# Altium project foc_control.PrjPcb
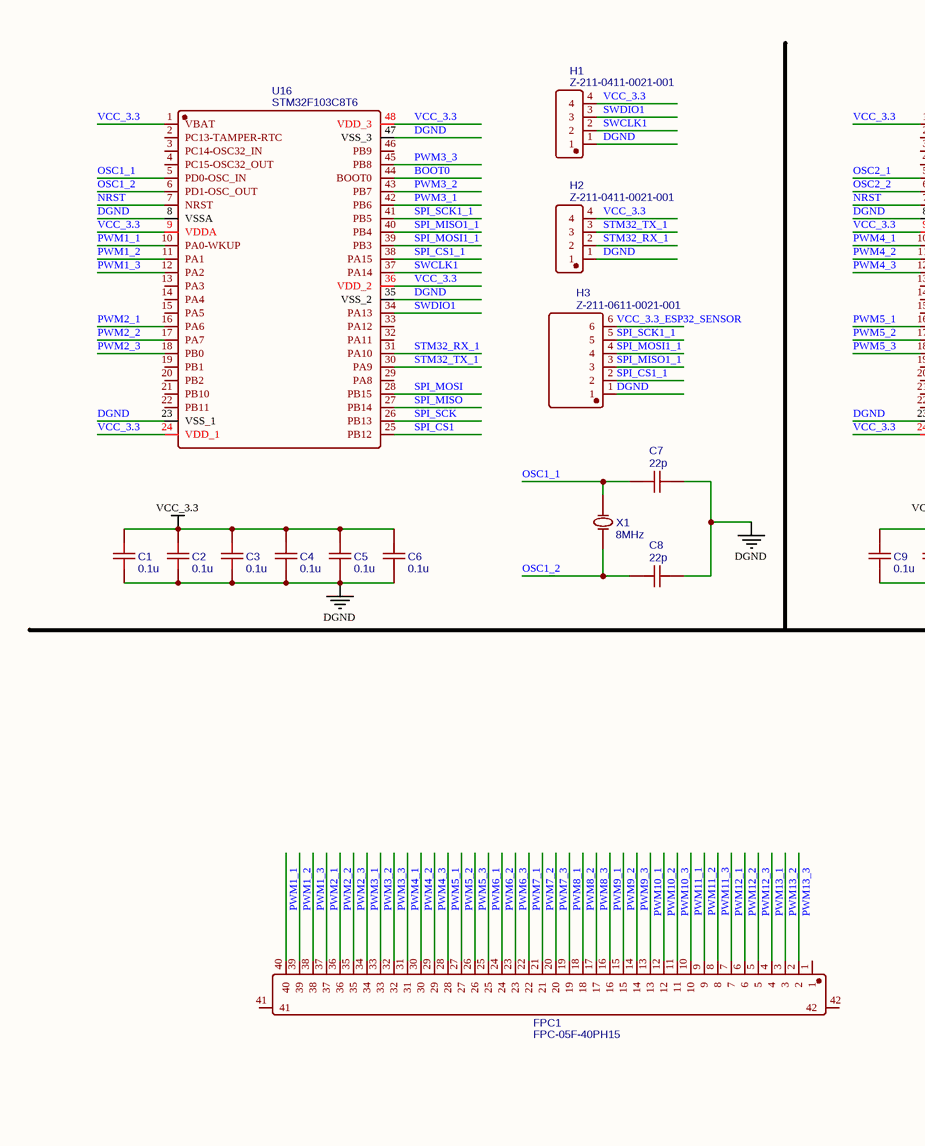
[diagram p0: quark_dog_control.schdoc, left]
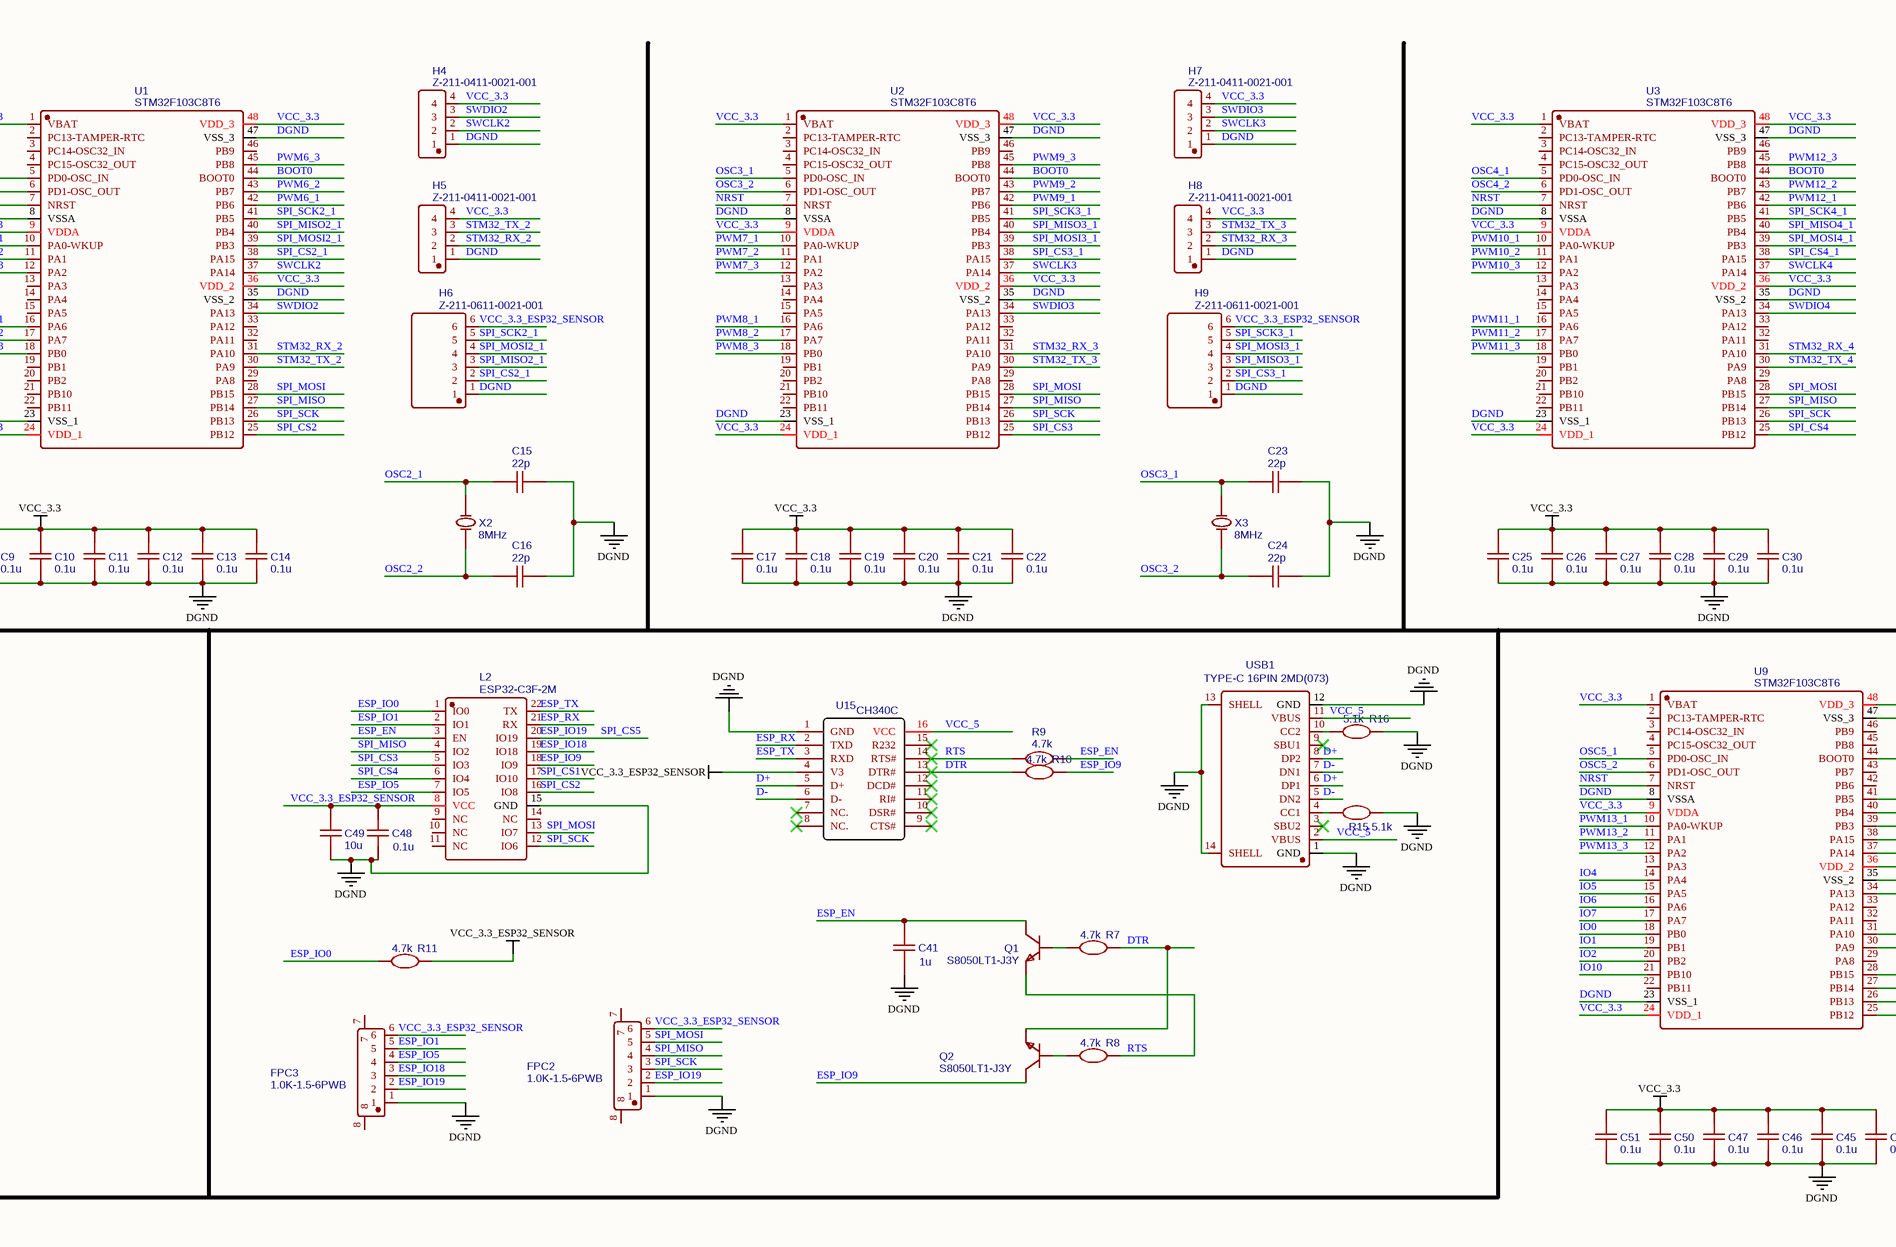
[diagram p1: quark_dog_control.schdoc, middle]
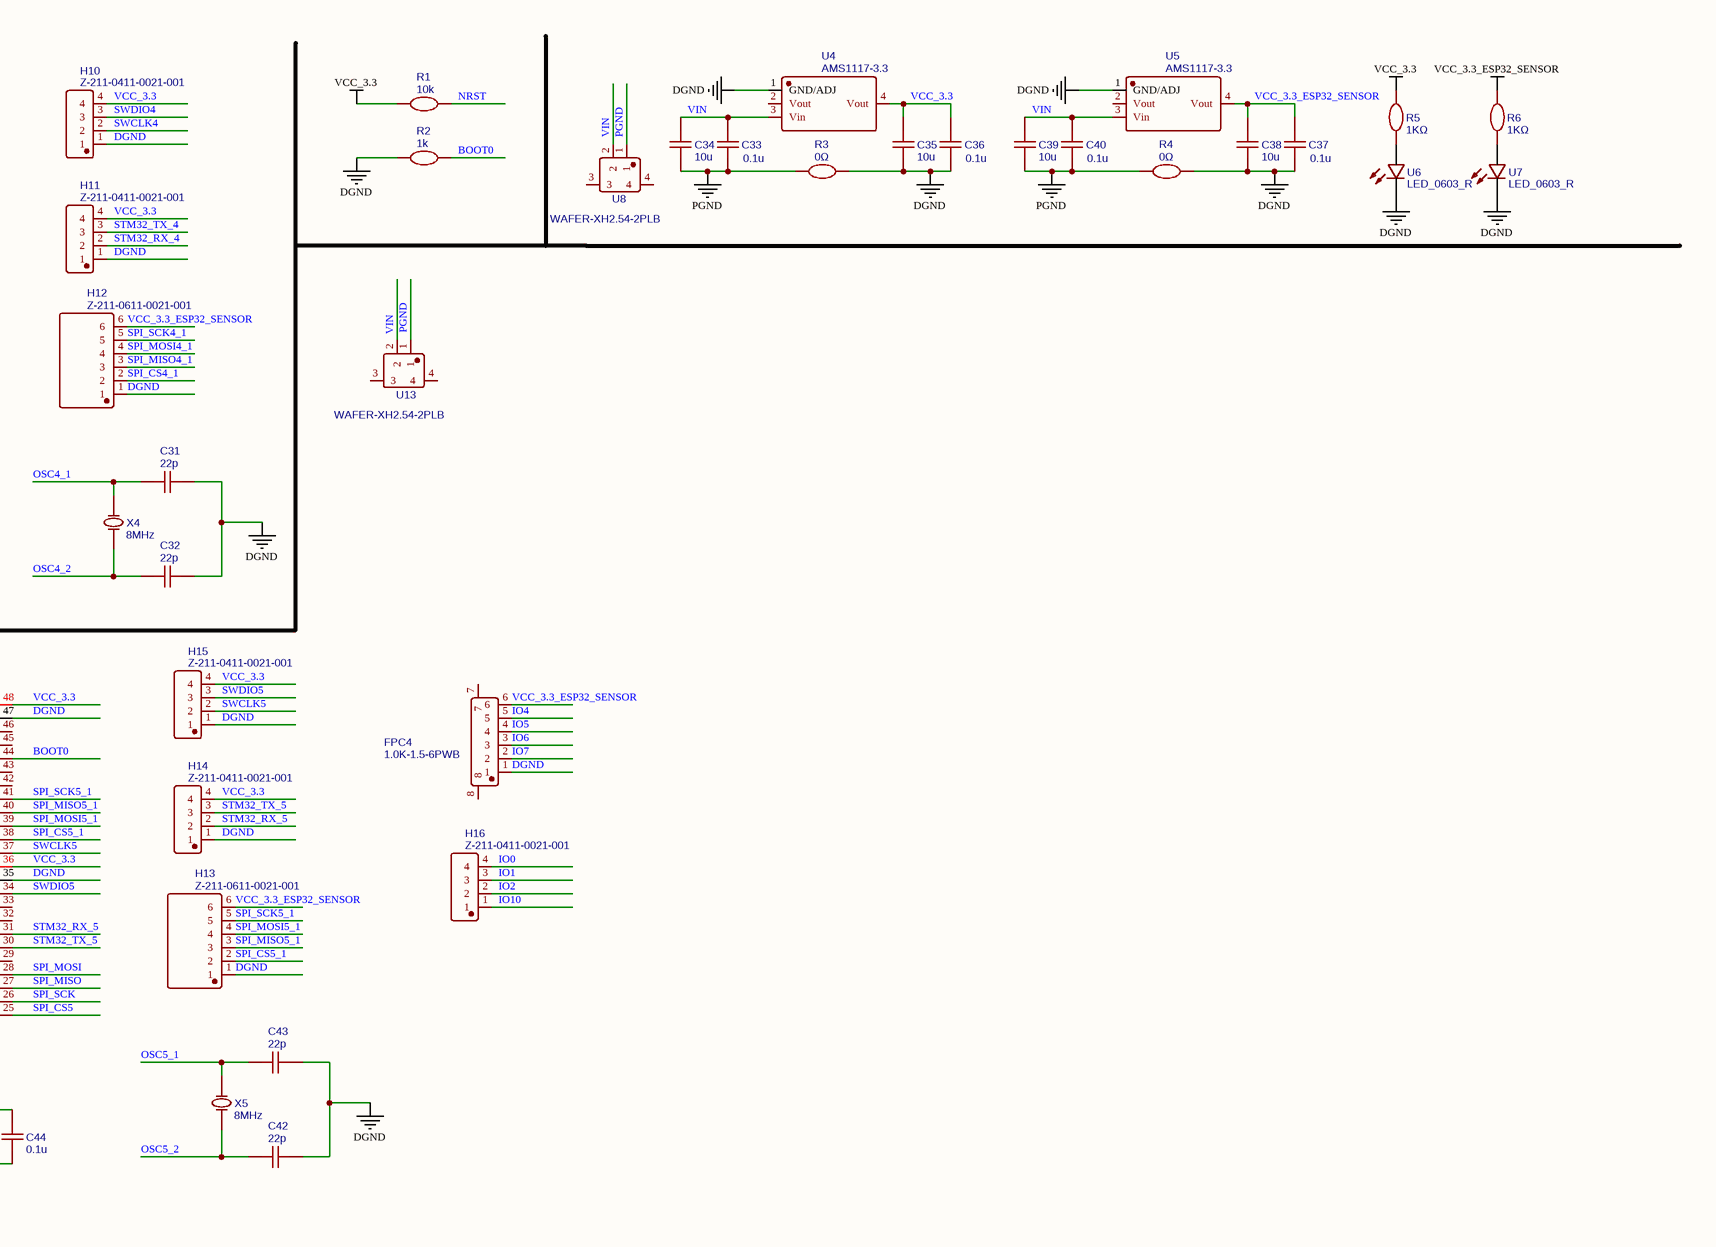
[diagram p2: quark_dog_control.schdoc, right]
1 sheet, 105 parts. Net scope: global (net labels, ports and power ports of the same name join across sheets).
Board file: quark_dog_control.PcbDoc

## Sheet quark_dog_control.schdoc
size 850 x 239 mm; SheetNumber: 1; SheetTotal: 1

### Parts
C1  0.1u  [C0603]
C2  0.1u  [C0603]
C3  0.1u  [C0603]
C4  0.1u  [C0603]
C5  0.1u  [C0603]
C6  0.1u  [C0603]
C7  22p  [C0603]
C8  22p  [C0603]
C9  0.1u  [C0603]
C10  0.1u  [C0603]
C11  0.1u  [C0603]
C12  0.1u  [C0603]
C13  0.1u  [C0603]
C14  0.1u  [C0603]
C15  22p  [C0603]
C16  22p  [C0603]
C17  0.1u  [C0603]
C18  0.1u  [C0603]
C19  0.1u  [C0603]
C20  0.1u  [C0603]
C21  0.1u  [C0603]
C22  0.1u  [C0603]
C23  22p  [C0603]
C24  22p  [C0603]
C25  0.1u  [C0603]
C26  0.1u  [C0603]
C27  0.1u  [C0603]
C28  0.1u  [C0603]
C29  0.1u  [C0603]
C30  0.1u  [C0603]
C31  22p  [C0603]
C32  22p  [C0603]
C33  0.1u  [C0603]
C34  10u  [C0603]
C35  10u  [C0603]
C36  0.1u  [C0603]
C37  0.1u  [C0603]
C38  10u  [C0603]
C39  10u  [C0603]
C40  0.1u  [C0603]
C41  1u  [C0603]
C42  22p  [C0603]
C43  22p  [C0603]
C44  0.1u  [C0603]
C45  0.1u  [C0603]
C46  0.1u  [C0603]
C47  0.1u  [C0603]
C48  0.1u  [C0603]
C49  10u  [C0603]
C50  0.1u  [C0603]
C51  0.1u  [C0603]
FPC1  FPC-05F-40PH15  [FPC-SMD_40P-P0.50_FPC-05F-40PH15]
FPC2  1.0K-1.5-6PWB  [FPC-SMD_6P-P1.00_HDGC_1.0K-1.5-6PWB]
FPC3  1.0K-1.5-6PWB  [FPC-SMD_6P-P1.00_HDGC_1.0K-1.5-6PWB]
FPC4  1.0K-1.5-6PWB  [FPC-SMD_6P-P1.00_HDGC_1.0K-1.5-6PWB]
H1  Z-211-0411-0021-001  [HDR-TH_4P-P2.54-V-M]
H2  Z-211-0411-0021-001  [HDR-TH_4P-P2.54-V-M]
H3  Z-211-0611-0021-001  [HDR-TH_6P-P2.54-V_Z-211-0611-0021-001]
H4  Z-211-0411-0021-001  [HDR-TH_4P-P2.54-V-M]
H5  Z-211-0411-0021-001  [HDR-TH_4P-P2.54-V-M]
H6  Z-211-0611-0021-001  [HDR-TH_6P-P2.54-V_Z-211-0611-0021-001]
H7  Z-211-0411-0021-001  [HDR-TH_4P-P2.54-V-M]
H8  Z-211-0411-0021-001  [HDR-TH_4P-P2.54-V-M]
H9  Z-211-0611-0021-001  [HDR-TH_6P-P2.54-V_Z-211-0611-0021-001]
H10  Z-211-0411-0021-001  [HDR-TH_4P-P2.54-V-M]
H11  Z-211-0411-0021-001  [HDR-TH_4P-P2.54-V-M]
H12  Z-211-0611-0021-001  [HDR-TH_6P-P2.54-V_Z-211-0611-0021-001]
H13  Z-211-0611-0021-001  [HDR-TH_6P-P2.54-V_Z-211-0611-0021-001]
H14  Z-211-0411-0021-001  [HDR-TH_4P-P2.54-V-M]
H15  Z-211-0411-0021-001  [HDR-TH_4P-P2.54-V-M]
H16  Z-211-0411-0021-001  [HDR-TH_4P-P2.54-V-M]
L2  ESP32-C3F-2M  [WIFIM-SMD_ESP32-C3F-2M]
Q1  S8050LT1-J3Y  [SOT-23_L2.9-W1.3-P1.90-LS2.4-BR]
Q2  S8050LT1-J3Y  [SOT-23_L2.9-W1.3-P1.90-LS2.4-BR]
R1  10k  [R0603]
R2  1k  [R0603]
R3  0Ω  [R0603]
R4  0Ω  [R0603]
R5  1KΩ  [R0603]
R6  1KΩ  [R0603]
R7  4.7k  [R0603]
R8  4.7k  [R0603]
R9  4.7k  [R0603]
R10  4.7k  [R0603]
R11  4.7k  [R0603]
R15  5.1k  [R0603]
R16  5.1k  [R0603]
U1  STM32F103C8T6  [LQFP-48_L7.0-W7.0-P0.50-LS9.0-BL]
U2  STM32F103C8T6  [LQFP-48_L7.0-W7.0-P0.50-LS9.0-BL]
U3  STM32F103C8T6  [LQFP-48_L7.0-W7.0-P0.50-LS9.0-BL]
U4  AMS1117-3.3  [SOT-223-3_L6.5-W3.4-P2.30-LS7.0-BR]
U5  AMS1117-3.3  [SOT-223-3_L6.5-W3.4-P2.30-LS7.0-BR]
U6  LED_0603_R  [LED0603-RD]
U7  LED_0603_R  [LED0603-RD]
U8  WAFER-XH2.54-2PLB  [CONN-SMD_2P-P2.50_XUNPU_WAFER-XH2.54-2PLB]
U9  STM32F103C8T6  [LQFP-48_L7.0-W7.0-P0.50-LS9.0-BL]
U13  WAFER-XH2.54-2PLB  [CONN-SMD_2P-P2.50_XUNPU_WAFER-XH2.54-2PLB]
U15  CH340C  [SOP-16_L10.0-W3.9-P1.27-LS6.0-BL]
U16  STM32F103C8T6  [LQFP-48_L7.0-W7.0-P0.50-LS9.0-BL]
USB1  TYPE-C 16PIN 2MD(073)  [USB-C-SMD_TYPE-C-6PIN-2MD-073]
X1  8MHz  [OSC-SMD_L5.0-W3.2]
X2  8MHz  [OSC-SMD_L5.0-W3.2]
X3  8MHz  [OSC-SMD_L5.0-W3.2]
X4  8MHz  [OSC-SMD_L5.0-W3.2]
X5  8MHz  [OSC-SMD_L5.0-W3.2]

### Nets
DGND: C1.1 C2.1 C3.1 C4.1 C5.1 C6.1 C7.1 C8.2 C9.1 C10.1 C11.1 C12.1 C13.1 C14.1 C15.1 C16.2 C17.1 C18.1 C19.1 C20.1 C21.1 C22.1 C23.1 C24.2 C25.1 C26.1 C27.1 C28.1 C29.1 C30.1 C31.1 C32.2 C35.1 C36.1 C37.1 C38.1 C41.1 C42.2 C43.1 C44.1 C45.1 C46.1 C47.1 C48.1 C49.1 C50.1 C51.1 FPC2.1 FPC3.1 FPC4.1 H1.1 H2.1 H3.1 H4.1 H5.1 H6.1 H7.1 H8.1 H9.1 H10.1 H11.1 H12.1 H13.1 H14.1 H15.1 L2.15(GND) R2.1 R3.2 R4.2 R15.2 R16.2 U1.8(VSSA) U1.23(VSS_1) U1.35(VSS_2) U1.47(VSS_3) U2.8(VSSA) U2.23(VSS_1) U2.35(VSS_2) U2.47(VSS_3) U3.8(VSSA) U3.23(VSS_1) U3.35(VSS_2) U3.47(VSS_3) U4.1(GND/ADJ) U5.1(GND/ADJ) U6.1(-) U7.1(-) U9.8(VSSA) U9.23(VSS_1) U9.35(VSS_2) U9.47(VSS_3) U15.1(GND) U16.8(VSSA) U16.23(VSS_1) U16.35(VSS_2) U16.47(VSS_3) USB1.1(GND) USB1.12(GND) USB1.13(SHELL) USB1.14(SHELL)
PGND: C33.1 C34.1 C39.1 C40.1 R3.1 R4.1 U8.1 U13.1
VCC_3.3: C1.2 C2.2 C3.2 C4.2 C5.2 C6.2 C9.2 C10.2 C11.2 C12.2 C13.2 C14.2 C17.2 C18.2 C19.2 C20.2 C21.2 C22.2 C25.2 C26.2 C27.2 C28.2 C29.2 C30.2 C35.2 C36.2 C44.2 C45.2 C46.2 C47.2 C50.2 C51.2 H1.4 H2.4 H4.4 H5.4 H7.4 H8.4 H10.4 H11.4 H14.4 H15.4 R1.1 R5.2 U1.1(VBAT) U1.9(VDDA) U1.24(VDD_1) U1.36(VDD_2) U1.48(VDD_3) U2.1(VBAT) U2.9(VDDA) U2.24(VDD_1) U2.36(VDD_2) U2.48(VDD_3) U3.1(VBAT) U3.9(VDDA) U3.24(VDD_1) U3.36(VDD_2) U3.48(VDD_3) U4.4(Vout) U9.1(VBAT) U9.9(VDDA) U9.24(VDD_1) U9.36(VDD_2) U9.48(VDD_3) U16.1(VBAT) U16.9(VDDA) U16.24(VDD_1) U16.36(VDD_2) U16.48(VDD_3)
VCC_3.3_ESP32_SENSOR: C37.2 C38.2 C48.2 C49.2 FPC2.6 FPC3.6 FPC4.6 H3.6 H6.6 H9.6 H12.6 H13.6 L2.8(VCC) R6.1 R11.2 U5.4(Vout) U15.4(V3)
BOOT0: R2.2 U1.44(BOOT0) U2.44(BOOT0) U3.44(BOOT0) U9.44(BOOT0) U16.44(BOOT0)
D+: U15.5(D+) USB1.6(DP1) USB1.8(DP2)
D-: U15.6(D-) USB1.5(DN2) USB1.7(DN1)
DTR: Q2.2 R7.2 R10.1 U15.13(DTR#)
ESP_EN: C41.2 L2.3(EN) Q1.3 R9.1
ESP_IO0: L2.1(IO0) R11.1
ESP_IO1: FPC3.5 L2.2(IO1)
ESP_IO5: FPC3.4 L2.7(IO5)
ESP_IO9: L2.18(IO9) Q2.3 R10.2
ESP_IO18: FPC3.3 L2.19(IO18)
ESP_IO19: FPC2.2 FPC3.2 L2.20(IO19) U9.25(PB12)  [also labelled SPI_CS5]
ESP_RX: L2.21(RX) U15.2(TXD)
ESP_TX: L2.22(TX) U15.3(RXD)
IO0: H16.4 U9.18(PB0)
IO1: H16.3 U9.19(PB1)
IO2: H16.2 U9.20(PB2)
IO4: FPC4.5 U9.14(PA4)
IO5: FPC4.4 U9.15(PA5)
IO6: FPC4.3 U9.16(PA6)
IO7: FPC4.2 U9.17(PA7)
IO10: H16.1 U9.21(PB10)
NRST: R1.2 U1.7(NRST) U2.7(NRST) U3.7(NRST) U9.7(NRST) U16.7(NRST)
OSC1_1: C7.2 U16.5(PD0-OSC_IN) X1.2(OSC2)
OSC1_2: C8.1 U16.6(PD1-OSC_OUT) X1.1(OSC1)
OSC2_1: C15.2 U1.5(PD0-OSC_IN) X2.2(OSC2)
OSC2_2: C16.1 U1.6(PD1-OSC_OUT) X2.1(OSC1)
OSC3_1: C23.2 U2.5(PD0-OSC_IN) X3.2(OSC2)
OSC3_2: C24.1 U2.6(PD1-OSC_OUT) X3.1(OSC1)
OSC4_1: C31.2 U3.5(PD0-OSC_IN) X4.2(OSC2)
OSC4_2: C32.1 U3.6(PD1-OSC_OUT) X4.1(OSC1)
OSC5_1: C43.2 U9.5(PD0-OSC_IN) X5.2(OSC2)
OSC5_2: C42.1 U9.6(PD1-OSC_OUT) X5.1(OSC1)
PWM1_1: FPC1.40 U16.10(PA0-WKUP)
PWM1_2: FPC1.39 U16.11(PA1)
PWM1_3: FPC1.38 U16.12(PA2)
PWM2_1: FPC1.37 U16.16(PA6)
PWM2_2: FPC1.36 U16.17(PA7)
PWM2_3: FPC1.35 U16.18(PB0)
PWM3_1: FPC1.34 U16.42(PB6)
PWM3_2: FPC1.33 U16.43(PB7)
PWM3_3: FPC1.32 U16.45(PB8)
PWM4_1: FPC1.31 U1.10(PA0-WKUP)
PWM4_2: FPC1.30 U1.11(PA1)
PWM4_3: FPC1.29 U1.12(PA2)
PWM5_1: FPC1.28 U1.16(PA6)
PWM5_2: FPC1.27 U1.17(PA7)
PWM5_3: FPC1.26 U1.18(PB0)
PWM6_1: FPC1.25 U1.42(PB6)
PWM6_2: FPC1.24 U1.43(PB7)
PWM6_3: FPC1.23 U1.45(PB8)
PWM7_1: FPC1.22 U2.10(PA0-WKUP)
PWM7_2: FPC1.21 U2.11(PA1)
PWM7_3: FPC1.20 U2.12(PA2)
PWM8_1: FPC1.19 U2.16(PA6)
PWM8_2: FPC1.18 U2.17(PA7)
PWM8_3: FPC1.17 U2.18(PB0)
PWM9_1: FPC1.16 U2.42(PB6)
PWM9_2: FPC1.15 U2.43(PB7)
PWM9_3: FPC1.14 U2.45(PB8)
PWM10_1: FPC1.13 U3.10(PA0-WKUP)
PWM10_2: FPC1.12 U3.11(PA1)
PWM10_3: FPC1.11 U3.12(PA2)
PWM11_1: FPC1.10 U3.16(PA6)
PWM11_2: FPC1.9 U3.17(PA7)
PWM11_3: FPC1.8 U3.18(PB0)
PWM12_1: FPC1.7 U3.42(PB6)
PWM12_2: FPC1.6 U3.43(PB7)
PWM12_3: FPC1.5 U3.45(PB8)
PWM13_1: FPC1.4 U9.10(PA0-WKUP)
PWM13_2: FPC1.3 U9.11(PA1)
PWM13_3: FPC1.2 U9.12(PA2)
RTS: Q1.2 R8.2 R9.2 U15.14(RTS#)
SPI_CS1: L2.17(IO10) U16.25(PB12)
SPI_CS1_1: H3.2 U16.38(PA15)
SPI_CS2: L2.16(IO8) U1.25(PB12)
SPI_CS2_1: H6.2 U1.38(PA15)
SPI_CS3: L2.5(IO3) U2.25(PB12)
SPI_CS3_1: H9.2 U2.38(PA15)
SPI_CS4: L2.6(IO4) U3.25(PB12)
SPI_CS4_1: H12.2 U3.38(PA15)
SPI_CS5_1: H13.2 U9.38(PA15)
SPI_MISO: FPC2.4 L2.4(IO2) U1.27(PB14) U2.27(PB14) U3.27(PB14) U9.27(PB14) U16.27(PB14)
SPI_MISO1_1: H3.3 U16.40(PB4)
SPI_MISO2_1: H6.3 U1.40(PB4)
SPI_MISO3_1: H9.3 U2.40(PB4)
SPI_MISO4_1: H12.3 U3.40(PB4)
SPI_MISO5_1: H13.3 U9.40(PB4)
SPI_MOSI: FPC2.5 L2.13(IO7) U1.28(PB15) U2.28(PB15) U3.28(PB15) U9.28(PB15) U16.28(PB15)
SPI_MOSI1_1: H3.4 U16.39(PB3)
SPI_MOSI2_1: H6.4 U1.39(PB3)
SPI_MOSI3_1: H9.4 U2.39(PB3)
SPI_MOSI4_1: H12.4 U3.39(PB3)
SPI_MOSI5_1: H13.4 U9.39(PB3)
SPI_SCK: FPC2.3 L2.12(IO6) U1.26(PB13) U2.26(PB13) U3.26(PB13) U9.26(PB13) U16.26(PB13)
SPI_SCK1_1: H3.5 U16.41(PB5)
SPI_SCK2_1: H6.5 U1.41(PB5)
SPI_SCK3_1: H9.5 U2.41(PB5)
SPI_SCK4_1: H12.5 U3.41(PB5)
SPI_SCK5_1: H13.5 U9.41(PB5)
STM32_RX_1: H2.2 U16.31(PA10)
STM32_RX_2: H5.2 U1.31(PA10)
STM32_RX_3: H8.2 U2.31(PA10)
STM32_RX_4: H11.2 U3.31(PA10)
STM32_RX_5: H14.2 U9.31(PA10)
STM32_TX_1: H2.3 U16.30(PA9)
STM32_TX_2: H5.3 U1.30(PA9)
STM32_TX_3: H8.3 U2.30(PA9)
STM32_TX_4: H11.3 U3.30(PA9)
STM32_TX_5: H14.3 U9.30(PA9)
SWCLK1: H1.2 U16.37(PA14)
SWCLK2: H4.2 U1.37(PA14)
SWCLK3: H7.2 U2.37(PA14)
SWCLK4: H10.2 U3.37(PA14)
SWCLK5: H15.2 U9.37(PA14)
SWDIO1: H1.3 U16.34(PA13)
SWDIO2: H4.3 U1.34(PA13)
SWDIO3: H7.3 U2.34(PA13)
SWDIO4: H10.3 U3.34(PA13)
SWDIO5: H15.3 U9.34(PA13)
VCC_5: U15.16(VCC) USB1.2(VBUS) USB1.11(VBUS)
VIN: C33.2 C34.2 C39.2 C40.2 U4.3(Vin) U5.3(Vin) U8.2 U13.2
NetQ1_1: Q1.1 R7.1
NetQ2_1: Q2.1 R8.1
NetR5_1: R5.1 U6.2(+)
NetR6_2: R6.2 U7.2(+)
NetR15_1: R15.1 USB1.4(CC1)
NetR16_1: R16.1 USB1.10(CC2)

Not connected (* = marked no-connect by the designer): FPC1 1 41 42; FPC2 7 8; FPC3 7 8; FPC4 7 8; L2 9(NC) 10(NC) 11(NC) 14(NC); U1 2(PC13-TAMPER-RTC) 3(PC14-OSC32_IN) 4(PC15-OSC32_OUT) 13(PA3) 14(PA4) 15(PA5) 19(PB1) 20(PB2) 21(PB10) 22(PB11) 29(PA8) 32(PA11) 33(PA12) 46(PB9); U2 2(PC13-TAMPER-RTC) 3(PC14-OSC32_IN) 4(PC15-OSC32_OUT) 13(PA3) 14(PA4) 15(PA5) 19(PB1) 20(PB2) 21(PB10) 22(PB11) 29(PA8) 32(PA11) 33(PA12) 46(PB9); U3 2(PC13-TAMPER-RTC) 3(PC14-OSC32_IN) 4(PC15-OSC32_OUT) 13(PA3) 14(PA4) 15(PA5) 19(PB1) 20(PB2) 21(PB10) 22(PB11) 29(PA8) 32(PA11) 33(PA12) 46(PB9); U4 2(Vout); U5 2(Vout); U8 3 4; U9 2(PC13-TAMPER-RTC) 3(PC14-OSC32_IN) 4(PC15-OSC32_OUT) 13(PA3) 22(PB11) 29(PA8) 32(PA11) 33(PA12) 42(PB6) 43(PB7) 45(PB8) 46(PB9); U13 3 4; U15 7(NC.)* 8(NC.)* 9(CTS#)* 10(DSR#)* 11(RI#)* 12(DCD#)* 15(R232)*; U16 2(PC13-TAMPER-RTC) 3(PC14-OSC32_IN) 4(PC15-OSC32_OUT) 13(PA3) 14(PA4) 15(PA5) 19(PB1) 20(PB2) 21(PB10) 22(PB11) 29(PA8) 32(PA11) 33(PA12) 46(PB9); USB1 3(SBU2)* 9(SBU1)*

### Library data of the parts
C1-C6 C9-C14 C17-C22 C25-C30 C44-C47 C50 C51 = 0.1u: nameAlias: Value(F); Contributor: LCEDA_Lib; spicePre: C; spiceSymbolName: C_0603_US
C7 C8 C15 C16 C23 C24 C31 C32 C42 C43 = 22p: nameAlias: Value(F); Contributor: LCEDA_Lib; spicePre: C; spiceSymbolName: C_0603_US
C33 C36 C37 C40 C48 = 0.1u: nameAlias: Value(F); Contributor: LCEDA_Lib; Package Display: No; spicePre: C; spiceSymbolName: C_0603_US
C34 C35 C38 C39 C49 = 10u: nameAlias: Value(F); Contributor: LCEDA_Lib; Package Display: No; spicePre: C; spiceSymbolName: C_0603_US
C41 = 1u: nameAlias: Value(F); Contributor: LCEDA_Lib; Package Display: No; spicePre: C; spiceSymbolName: C_0603_US
FPC1 = FPC-05F-40PH15: BOM_Manufacturer: XUNPU(讯普); Contributor: LCSC; BOM_Supplier: LCSC; BOM_Supplier Part: C2856825; BOM_Manufacturer Part: FPC-05F-40PH15; BOM_JLCPCB Part Class: Extended Part; spicePre: F; spiceSymbolName: FPC-05F-40PH15
FPC2-FPC4 = 1.0K-1.5-6PWB: BOM_Manufacturer: HDGC(华德共创); Contributor: LCSC; BOM_Supplier: LCSC; BOM_Supplier Part: C2919568; BOM_Manufacturer Part: 1.0K-1.5-6PWB; BOM_JLCPCB Part Class: Extended Part; spicePre: F; spiceSymbolName: 1.0K-1.5-6PWB
H1 H2 H4 H5 H7 H8 H10 H11 H14-H16 = Z-211-0411-0021-001: BOM_Manufacturer: ZHENGLING; Contributor: LCSC; BOM_Supplier: LCSC; BOM_Manufacturer Part: Z-211-0411-0021-001; BOM_Supplier Part: C152150; BOM_JLCPCB Part Class: Extended Part; spicePre: H; spiceSymbolName: Z-211-0411-0021-001
H3 H6 H9 H12 H13 = Z-211-0611-0021-001: BOM_Manufacturer: Nextronics Engineering; Contributor: LCSC; BOM_Supplier: LCSC; BOM_Supplier Part: C190819; BOM_Manufacturer Part: Z-211-0611-0021-001; BOM_JLCPCB Part Class: Extended Part; spicePre: H; spiceSymbolName: Z-211-0611-0021-001
L2 = ESP32-C3F-2M: BOM_Manufacturer: Ai-Thinker(安信可); Contributor: LCSC; BOM_Supplier: LCSC; BOM_Supplier Part: C2830867; BOM_Manufacturer Part: ESP32-C3F-2M; BOM_JLCPCB Part Class: Extended Part; spicePre: L; spiceSymbolName: ESP32-C3F-2M
Q1 Q2 = S8050LT1-J3Y: BOM_Manufacturer: FH(风华); Contributor: lcsc; BOM_Supplier: LCSC; BOM_Supplier Part: C2962087; BOM_Manufacturer Part: S8050LT1-J3Y; link: https://atta.szlcsc.com/upload/public/pdf/source/20220411/740B3F4857AB400E9826209E74F1EDA4.pdf; BOM_JLCPCB Part Class: Extended Part; spicePre: Q; spiceSymbolName: S8050LT1-J3Y
R1 = 10k: nameAlias: Value(Ω); Contributor: LCEDA_Lib; spicePre: R; spiceSymbolName: R_0603_EU
R2 = 1k: nameAlias: Value(Ω); Contributor: LCEDA_Lib; spicePre: R; spiceSymbolName: R_0603_EU
R3 R4 = 0Ω: nameAlias: Value(Ω); Contributor: LCEDA_Lib; spicePre: R; spiceSymbolName: R_0603_EU
R5 R6 = 1KΩ: nameAlias: Value(Ω); Contributor: LCEDA_Lib; spicePre: R; spiceSymbolName: R_0603_EU
R7-R11 = 4.7k: nameAlias: Value(Ω); Contributor: LCEDA_Lib; spicePre: R; spiceSymbolName: R_0603_EU
R15 R16 = 5.1k: nameAlias: Value(Ω); Contributor: LCEDA_Lib; spicePre: R; spiceSymbolName: R_0603_EU
U1-U3 U9 U16 = STM32F103C8T6: BOM_Manufacturer: STMicroelectronics; SMT Type: Basic; timeStamp: 1455028086; BOM_Supplier: LCSC; BOM_Manufacturer Part: STM32F103C8T6; BOM_LCSC Assembly: Yes; image: //image.lceda.cn/szlcsc/C8734.jpg; BOM_Supplier Part: C8734; spicePre: U; spiceSymbolName: STM32F103C8T6
U4 U5 = AMS1117-3.3: BOM_Manufacturer: AMS; sourceId: dwIGgezVh; timeStamp: 1476261164; BOM_Supplier: LCSC; BOM_Manufacturer Part: AMS1117-3.3; BOM_Supplier Part: C6186; BOM_JLCPCB Part Class: Basic Part; spicePre: U; spiceSymbolName: AMS1117-3.3
U6 U7 = LED_0603_R: BOM_Manufacturer: null; Contributor: lcsc; BOM_Supplier: LCSC; BOM_Supplier Part: C9900016084; BOM_Manufacturer Part: LED_0603_R; BOM_JLCPCB Part Class: Extended Part; spicePre: U; spiceSymbolName: LED_0603_R
U8 U13 = WAFER-XH2.54-2PLB: BOM_Manufacturer: XUNPU(讯普); Contributor: lcsc; BOM_Supplier: LCSC; BOM_Supplier Part: C3029467; BOM_Manufacturer Part: WAFER-XH2.54-2PLB; link: https://atta.szlcsc.com/upload/public/pdf/source/20220527/139842C6548CEDBA8D9F0F4A441614CD.pdf; BOM_JLCPCB Part Class: Extended Part; spicePre: U; spiceSymbolName: WAFER-XH2.54-2PLB
U15 = CH340C: BOM_Manufacturer: WCH; BOM_Paste Type: recommend; BOM_Supplier: LCSC; BOM_Manufacturer Part: CH340C; BOM_Supplier Part: C84681; spicePre: U; spiceSymbolName: CH340C
USB1 = TYPE-C 16PIN 2MD(073): BOM_Manufacturer: SHOU HAN(首韩); Contributor: LCSC; BOM_Supplier: LCSC; BOM_Supplier Part: C2765186; BOM_Manufacturer Part: TYPE-C 16PIN 2MD(073); BOM_JLCPCB Part Class: Extended Part; spicePre: U; spiceSymbolName: TYPE-C 16PIN 2MD(073)
X1-X5 = 8MHz: BOM_Manufacturer: TXC Corp; BOM_Manufacturer Part: 7A08000001; nameAlias: Frequency; Contributor: LCSC; BOM_Supplier: LCSC; BOM_Supplier Part: C331616; BOM_JLCPCB Part Class: Extended Part; spicePre: X; spiceSymbolName: 7A08000001